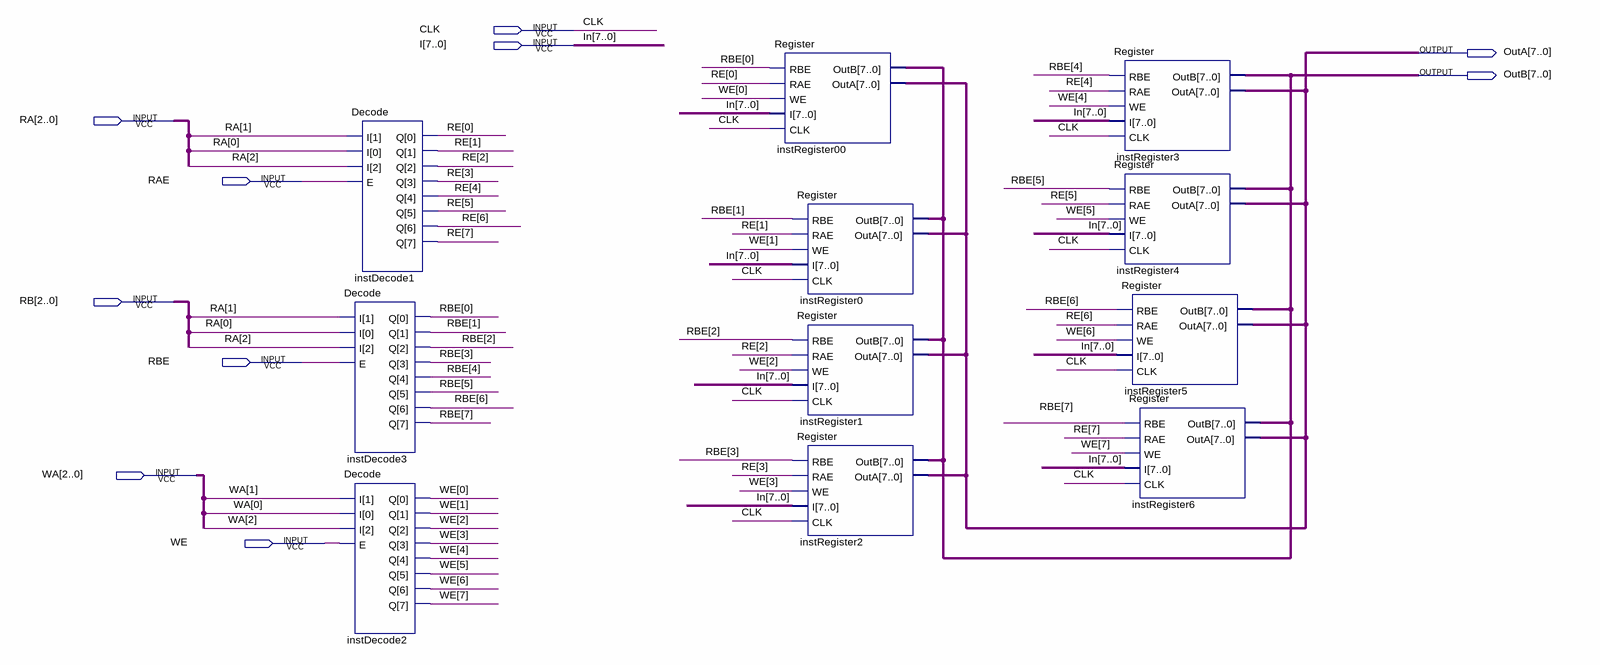
[diagram p0: schematic sheet]
// Quartus schematic 8Register8bit.bdf as structural Verilog: 11 symbols, 10 pins
module \8Register8bit  (
  input  CLK,
  input  [7:0] I,
  input  [2:0] RA,
  input  RAE,
  input  [2:0] RB,
  input  RBE,
  input  [2:0] WA,
  input  WE,
  output [7:0] OutA,
  output [7:0] OutB
);

  wire [7:0] RBE_bus, RE, WE_bus;

  Decode instDecode1 (.I(RA), .E(RAE), .Q(RE));
  Decode instDecode3 (.I(RA), .E(RBE), .Q(RBE_bus));
  Decode instDecode2 (.I(WA), .E(WE), .Q(WE_bus));
  Register instRegister00 (.RBE(RBE_bus[0]), .RAE(RE[0]), .WE(WE_bus[0]), .I(I), .CLK(CLK), .OutB(OutB), .OutA(OutA));
  Register instRegister0 (.RBE(RBE_bus[1]), .RAE(RE[1]), .WE(WE_bus[1]), .I(I), .CLK(CLK), .OutB(OutB), .OutA(OutA));
  Register instRegister1 (.RBE(RBE_bus[2]), .RAE(RE[2]), .WE(WE_bus[2]), .I(I), .CLK(CLK), .OutB(OutB), .OutA(OutA));
  Register instRegister2 (.RBE(RBE_bus[3]), .RAE(RE[3]), .WE(WE_bus[3]), .I(I), .CLK(CLK), .OutB(OutB), .OutA(OutA));
  Register instRegister3 (.RBE(RBE_bus[4]), .RAE(RE[4]), .WE(WE_bus[4]), .I(I), .CLK(CLK), .OutB(OutB), .OutA(OutA));
  Register instRegister4 (.RBE(RBE_bus[5]), .RAE(RE[5]), .WE(WE_bus[5]), .I(I), .CLK(CLK), .OutB(OutB), .OutA(OutA));
  Register instRegister5 (.RBE(RBE_bus[6]), .RAE(RE[6]), .WE(WE_bus[6]), .I(I), .CLK(CLK), .OutB(OutB), .OutA(OutA));
  Register instRegister6 (.RBE(RBE_bus[7]), .RAE(RE[7]), .WE(WE_bus[7]), .I(I), .CLK(CLK), .OutB(OutB), .OutA(OutA));

  // Other names for the same wires on the sheet: In[7:0] = I
endmodule
